# EasyEDA schematic ledstripschematic.json
TITLE: Sheet_1; REV: 1.0; Date: 2024-03-28; Sheet: 1/1; Drawn By: znegin20; Company: Your Company
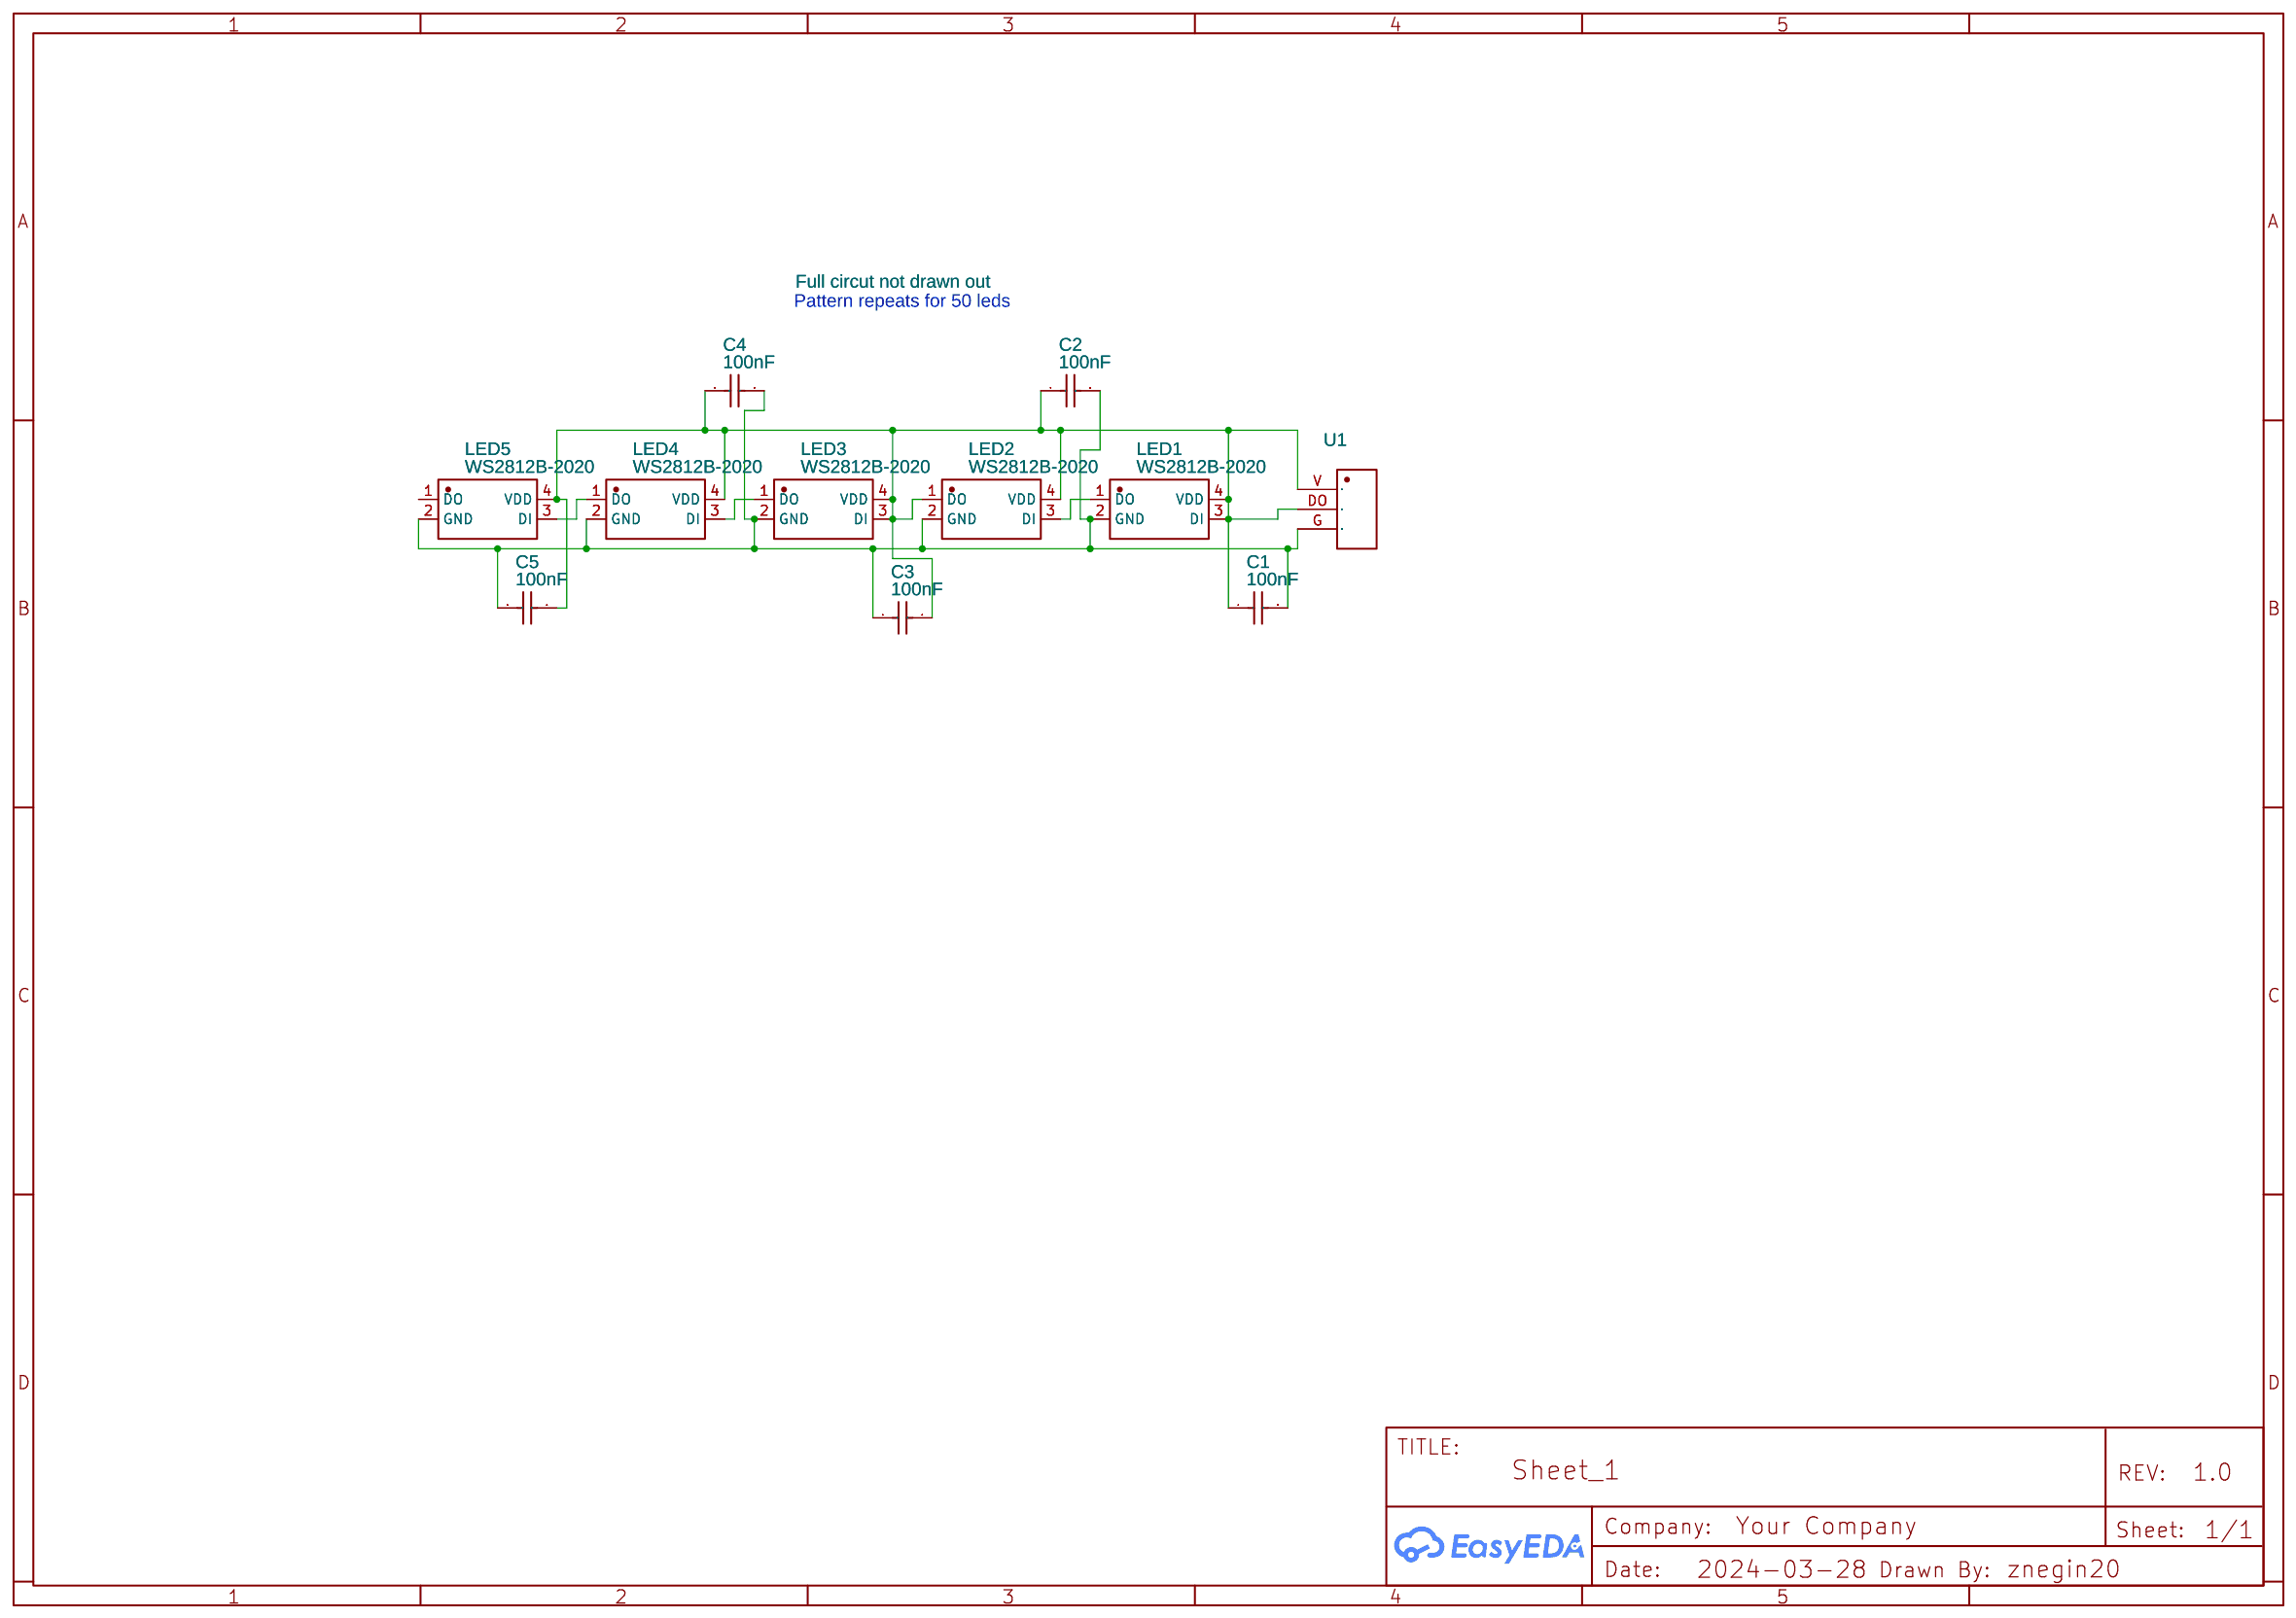
[diagram p0: schematic sheet]

## Parts
C1  100nF  [C0402]
C2  100nF  [C0402]
C3  100nF  [C0402]
C4  100nF  [C0402]
C5  100nF  [C0402]
LED1  WS2812B-2020  [LED-SMD_4P-L2.0-W2.0-TL_WS2812B-2020]
LED2  WS2812B-2020  [LED-SMD_4P-L2.0-W2.0-TL_WS2812B-2020]
LED3  WS2812B-2020  [LED-SMD_4P-L2.0-W2.0-TL_WS2812B-2020]
LED4  WS2812B-2020  [LED-SMD_4P-L2.0-W2.0-TL_WS2812B-2020]
LED5  WS2812B-2020  [LED-SMD_4P-L2.0-W2.0-TL_WS2812B-2020]
U1  Full circut not drawn out  [HDR-TH_3P-P2.54-V-M-1]

## Library data of the parts
C1-C5 = CL05B104KO5NNNC: Supplier: LCSC; Manufacturer: SAMSUNG(三星); Supplier Part: C1525; JLCPCB Part Class: Basic Part
LED1-LED5 = WS2812B-2020: Contributor: LCSC; Supplier: LCSC; Supplier Part: C965555; Manufacturer: worldsemi; JLCPCB Part Class: Extended Part
U1 = A2-3PA-2.54DSA(71): Contributor: LCSC; Supplier: LCSC; Supplier Part: C325000; Manufacturer: HRS(广濑); JLCPCB Part Class: Extended Part

## Nets
Net-(C1-1): C1.1 C2.1 C3.2 C4.1 C5.2 LED1.3(DI) LED1.4(VDD) LED2.1(DO) LED2.4(VDD) LED3.3(DI) LED3.4(VDD) LED4.4(VDD) LED5.4(VDD) U1.DO(2) U1.V(1)
Net-(C1-2): C1.2 C2.2 C3.1 C4.2 C5.1 LED1.2(GND) LED2.2(GND) LED3.2(GND) LED4.2(GND) LED5.2(GND) U1.G(3)
Net-(LED1-1): LED1.1(DO) LED2.3(DI)
Net-(LED3-1): LED3.1(DO) LED4.3(DI)
Net-(LED4-1): LED4.1(DO) LED5.3(DI)

Not connected (* = marked no-connect by the designer): LED5 1(DO)

## Notes on the sheet
- Pattern repeats for 50 leds
